# EAGLE design wordclockv0.1 (EAGLE 9.2.0)
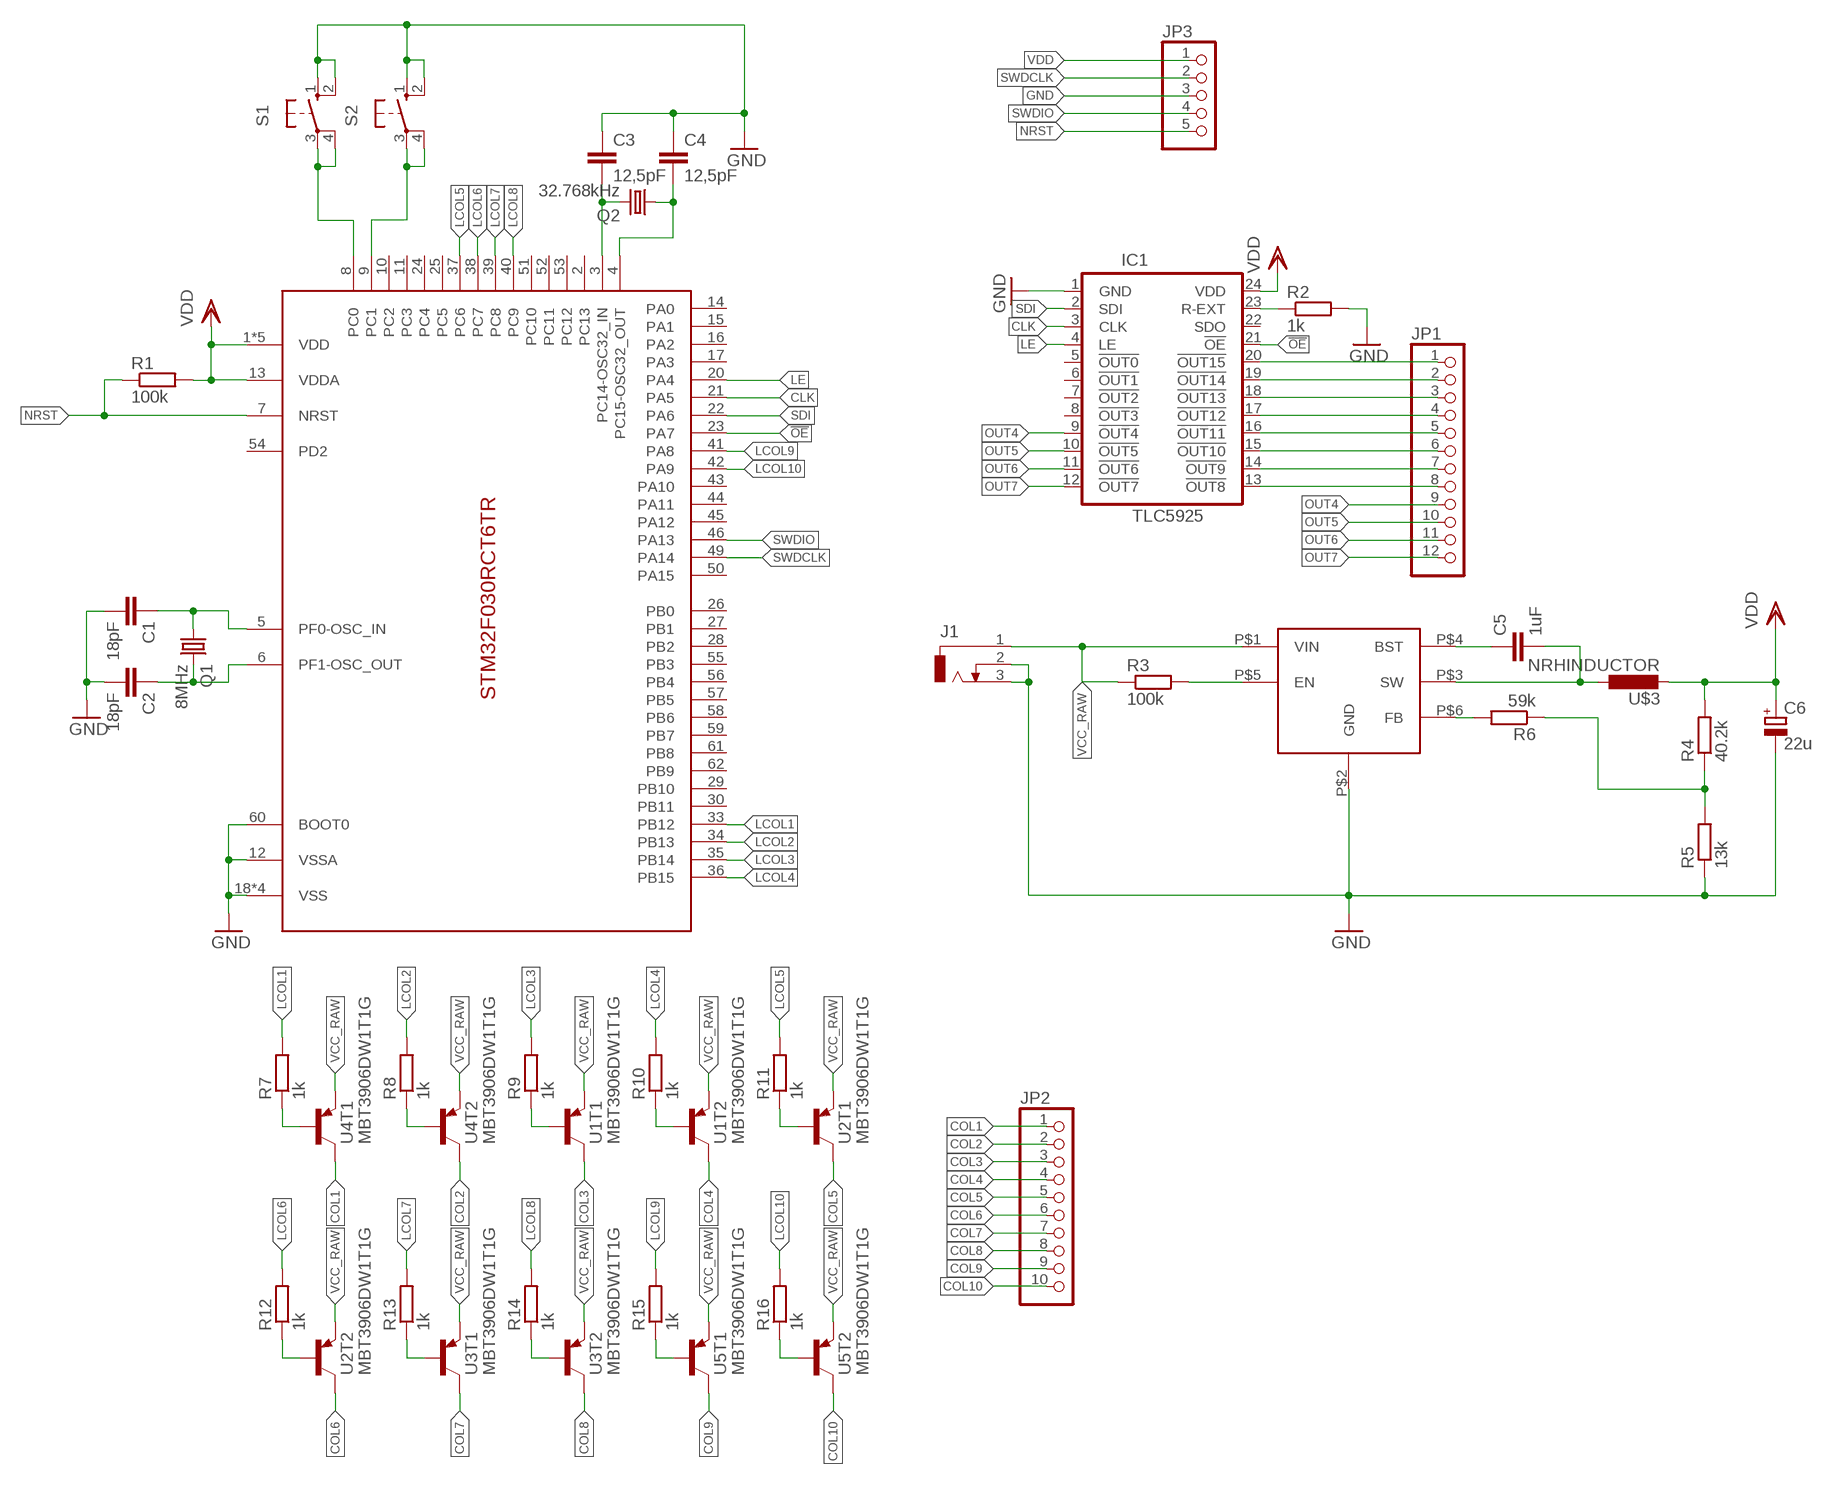
[diagram p0: schematic, sheet 1]

## Parts
C1  18pF  C-EUC0402  [C0402]
C2  18pF  C-EUC0402  [C0402]
C3  12,5pF  C-EUC0402  [C0402]
C4  12,5pF  C-EUC0402  [C0402]
C5  1uF  C-EUC0805  [C0805]
C6  22u  CPOL-EU153CLV-0405  [153CLV-0405]
IC1  TLC5925  [SO24W]
J1  DCJ0303  [DCJ0303]
JP1  PINHD-1X12  [1X12]
JP2  PINHD-1X10  [1X10]
JP3  PINHD-1X5  [1X05]
Q1  8MHz  CRYSTALHC49U-V  [HC49U-V]
Q2  32.768kHz  CRYSTALTC26V  [TC26V]
R1  100k  R-EU_M1206  [M1206]
R2  1k  R-EU_M1206  [M1206]
R3  100k  R-EU_M1206  [M1206]
R4  40.2k  R-EU_M1206  [M1206]
R5  13k  R-EU_M1206  [M1206]
R6  59k  R-EU_M1206  [M1206]
R7  1k  R-EU_M1206  [M1206]
R8  1k  R-EU_M1206  [M1206]
R9  1k  R-EU_M1206  [M1206]
R10  1k  R-EU_M1206  [M1206]
R11  1k  R-EU_M1206  [M1206]
R12  1k  R-EU_M1206  [M1206]
R13  1k  R-EU_M1206  [M1206]
R14  1k  R-EU_M1206  [M1206]
R15  1k  R-EU_M1206  [M1206]
R16  1k  R-EU_M1206  [M1206]
S1  10-XX  [B3F-10XX]
S2  10-XX  [B3F-10XX]
U1  MBT3906DW1T1G  [SOT363-INFINION]
U2  MBT3906DW1T1G  [SOT363-INFINION]
U3  MBT3906DW1T1G  [SOT363-INFINION]
U4  MBT3906DW1T1G  [SOT363-INFINION]
U5  MBT3906DW1T1G  [SOT363-INFINION]
U$1  STM32F030RCT6TRLQFP64  [LQFP64]
U$2  AP65111A  [TSOT26]
U$3  NRHINDUCTOR  [NRHINDUCTOR]

## Nets
!OE: IC1.21(!OE) U$1.23(PA7)
CLK: IC1.3(CLK) U$1.21(PA5)
COL1: JP2.1 U4.6(T1:C)
COL2: JP2.2 U4.3(T2:C)
COL3: JP2.3 U1.6(T1:C)
COL4: JP2.4 U1.3(T2:C)
COL5: JP2.5 U2.6(T1:C)
COL6: JP2.6 U2.3(T2:C)
COL7: JP2.7 U3.6(T1:C)
COL8: JP2.8 U3.3(T2:C)
COL9: JP2.9 U5.6(T1:C)
COL10: JP2.10 U5.3(T2:C)
GND: C1.2 C2.2 C3.1 C4.1 C6.- IC1.1(GND) J1.2 J1.3 JP3.3 R2.2 R5.1 S1.1(S) S1.2(S1) S2.1(S) S2.2(S1) U$1.12(VSSA) U$1.18(VSS) U$1.31(VSS) U$1.47(VSS) U$1.60(BOOT0) U$1.63(VSS) U$2.P$2(GND)
LCOL1: R7.2 U$1.33(PB12)
LCOL2: R8.2 U$1.34(PB13)
LCOL3: R9.2 U$1.35(PB14)
LCOL4: R10.2 U$1.36(PB15)
LCOL5: R11.2 U$1.37(PC6)
LCOL6: R12.2 U$1.38(PC7)
LCOL7: R13.2 U$1.39(PC8)
LCOL8: R14.2 U$1.40(PC9)
LCOL9: R15.2 U$1.41(PA8)
LCOL10: R16.2 U$1.42(PA9)
LE: IC1.4(LE) U$1.20(PA4)
N$1: C1.1 Q1.1 U$1.5(PF0-OSC_IN)
N$2: C2.1 Q1.2 U$1.6(PF1-OSC_OUT)
N$3: C4.2 Q2.1 U$1.4(PC15-OSC32_OUT)
N$4: C3.2 Q2.2 U$1.3(PC14-OSC32_IN)
N$6: C5.1 U$2.P$4(BST)
N$7: R3.2 U$2.P$5(EN)
N$9: IC1.23(R-EXT) R2.1
N$10: C5.2 U$2.P$3(SW) U$3.P$1
N$11: R6.2 U$2.P$6(FB)
N$12: R4.1 R5.2 R6.1
N$13: R7.1 U4.2(T1:B)
N$14: R8.1 U4.5(T2:B)
N$16: S1.3(P) S1.4(P1) U$1.8(PC0)
N$17: R9.1 U1.2(T1:B)
N$18: R10.1 U1.5(T2:B)
N$20: S2.3(P) S2.4(P1) U$1.9(PC1)
N$21: R11.1 U2.2(T1:B)
N$22: R12.1 U2.5(T2:B)
N$24: IC1.20(!OUT15) JP1.1
N$25: IC1.19(!OUT14) JP1.2
N$26: IC1.18(!OUT13) JP1.3
N$27: IC1.17(!OUT12) JP1.4
N$28: IC1.16(!OUT11) JP1.5
N$29: IC1.15(!OUT10) JP1.6
N$30: IC1.14(!OUT9) JP1.7
N$31: IC1.13(!OUT8) JP1.8
N$35: R13.1 U3.2(T1:B)
N$36: R14.1 U3.5(T2:B)
N$39: R15.1 U5.2(T1:B)
N$40: R16.1 U5.5(T2:B)
NRST: JP3.5 R1.1 U$1.7(NRST)
OUT4: IC1.9(!OUT4) JP1.9
OUT5: IC1.10(!OUT5) JP1.10
OUT6: IC1.11(!OUT6) JP1.11
OUT7: IC1.12(!OUT7) JP1.12
SDI: IC1.2(SDI) U$1.22(PA6)
SWDCLK: JP3.2 U$1.49(PA14)
SWDIO: JP3.4 U$1.46(PA13)
VCC_RAW: J1.1 R3.1 U1.1(T1:E) U1.4(T2:E) U2.1(T1:E) U2.4(T2:E) U3.1(T1:E) U3.4(T2:E) U4.1(T1:E) U4.4(T2:E) U5.1(T1:E) U5.4(T2:E) U$2.P$1(VIN)
VDD: C6.+ IC1.24(VDD) JP3.1 R1.2 R4.2 U$1.1(VDD) U$1.13(VDDA) U$1.19(VDD) U$1.32(VDD) U$1.48(VDD) U$1.64(VDD) U$3.P$2
Unconnected: IC1.5(!OUT0) IC1.6(!OUT1) IC1.7(!OUT2) IC1.8(!OUT3) IC1.22(SDO) U$1.2(PC13) U$1.10(PC2) U$1.11(PC3) U$1.14(PA0) U$1.15(PA1) U$1.16(PA2) U$1.17(PA3) U$1.24(PC4) U$1.25(PC5) U$1.26(PB0) U$1.27(PB1) U$1.28(PB2) U$1.29(PB10) U$1.30(PB11) U$1.43(PA10) U$1.44(PA11) U$1.45(PA12) U$1.50(PA15) U$1.51(PC10) U$1.52(PC11) U$1.53(PC12) U$1.54(PD2) U$1.55(PB3) U$1.56(PB4) U$1.57(PB5) U$1.58(PB6) U$1.59(PB7) U$1.61(PB8) U$1.62(PB9)

## Library data of the parts
C1 C3 C5 = rcl:C-EU: CAPACITOR, European symbol
C2 C4 = rcl:C-EU: CAPACITOR, European symbol; SPICEPREFIX: C
C6 = rcl:CPOL-EU: POLARIZED CAPACITOR, European symbol
IC1 = Treiberplatine:TLC5925
J1 = con-jack:DCJ0303: DC POWER JACK Source: DCJ0303.pdf; OC_FARNELL: unknown; OC_NEWARK: unknown
JP1 = pinhead:PINHD-1X12: PIN HEADER
JP2 = pinhead:PINHD-1X10: PIN HEADER
JP3 = pinhead:PINHD-1X5: PIN HEADER
Q1 = crystal:CRYSTAL: CRYSTAL; OC_FARNELL: 1666969; OC_NEWARK: unknown
Q2 = crystal:CRYSTAL: CRYSTAL; OC_FARNELL: unknown; OC_NEWARK: unknown
R1-R16 = rcl:R-EU_: RESISTOR, European symbol; SPICEPREFIX: R
S1 S2 = switch-omron:10-XX: OMRON SWITCH; MPN: B3F-1000; OC_FARNELL: 176432; OC_NEWARK: 36M3542
U1-U5 = STM32F030RCT6TR:MBT3906DW1T1G
U$1 = STM32F030RCT6TR:STM32F030RCT6TR
U$2 = STM32F030RCT6TR:AP65111A
U$3 = STM32F030RCT6TR:NRHINDUCTOR

## Board
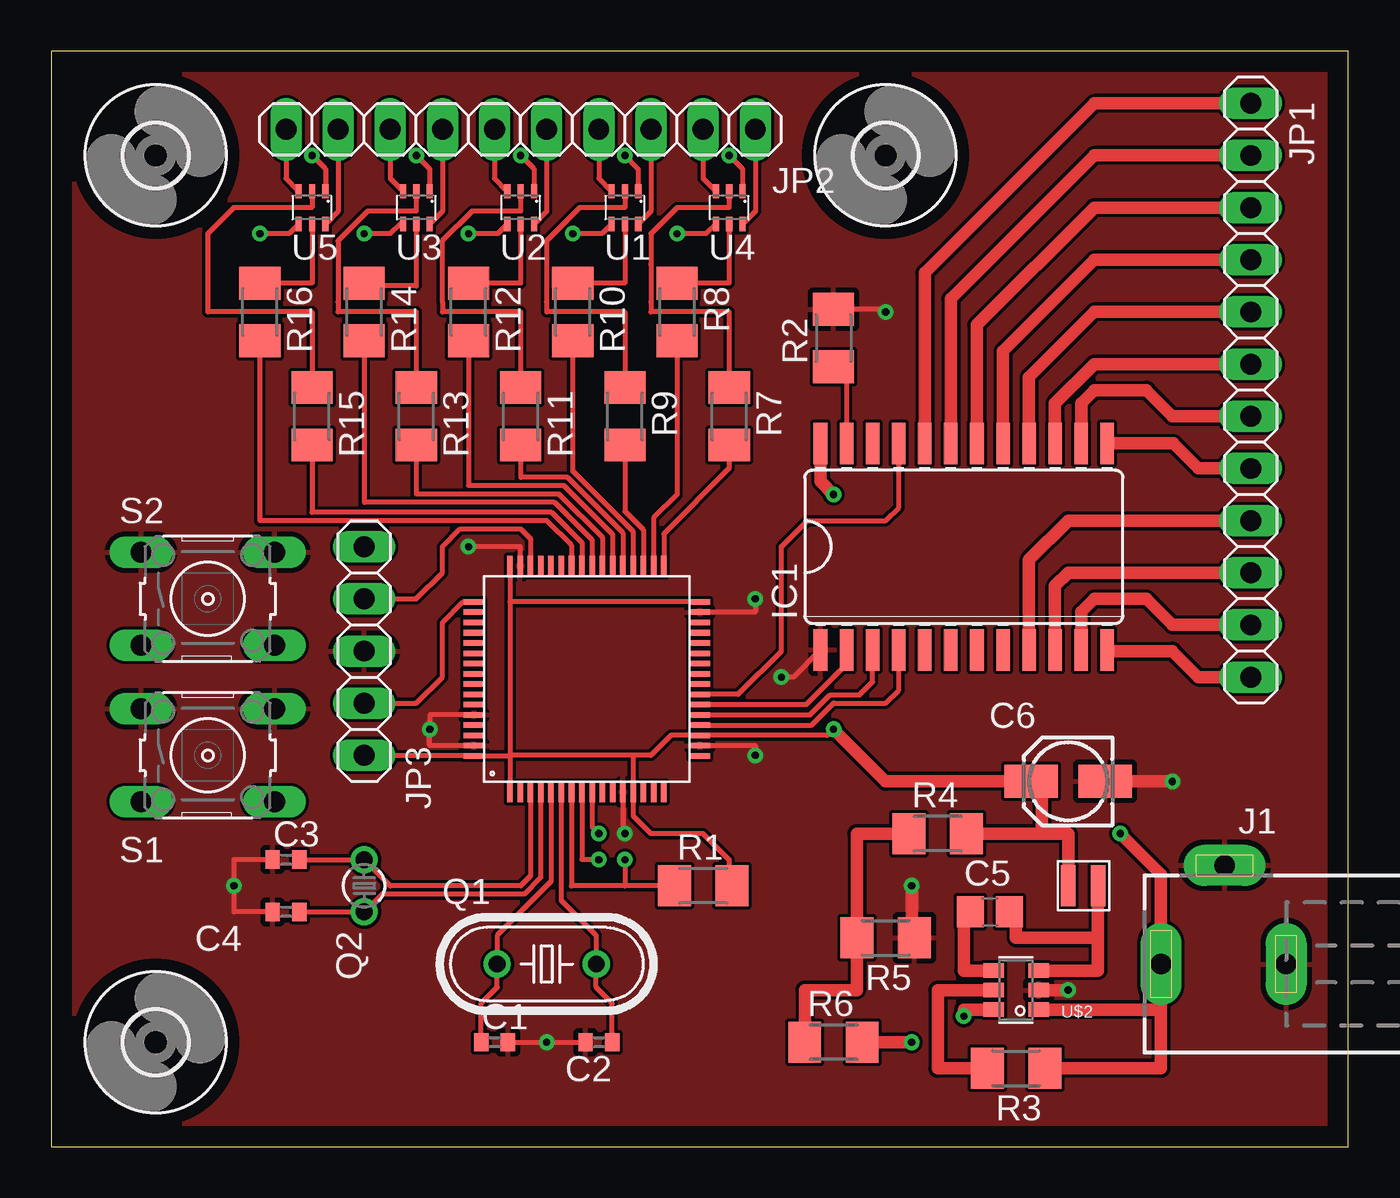
[diagram p1: board, top side]
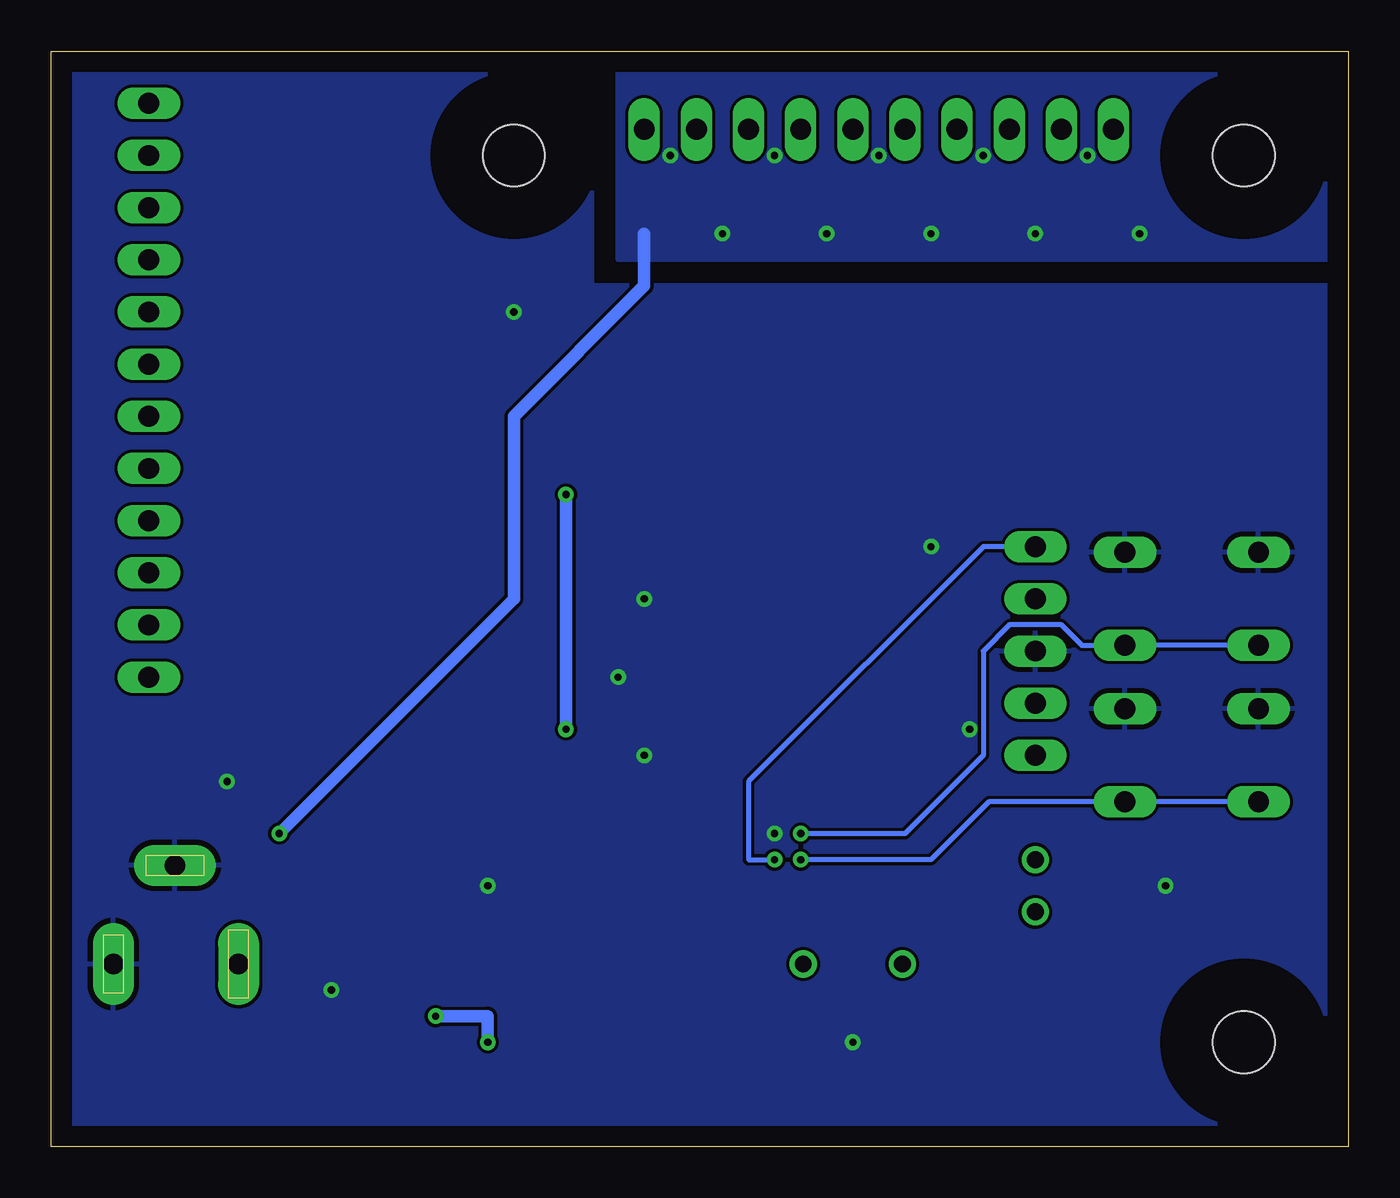
[diagram p2: board, bottom side, seen from below]

Size 63.17 x 53.33 mm. Coordinates in mm from the lower left corner, seen from the top.
Outline: 0,0 63.17,0 63.17,53.33 0,53.33 0,0
Copper layers (1*16): Top 0.035mm / dielectric 1.5mm / Bottom 0.035mm
Design rules "default *": minimum track width 6mil, minimum drill 0.35mm, track to track 6mil, track to pad 6mil, pad to pad 6mil, via to via 6mil, smd to smd 6mil, copper to edge 40mil, drill to drill 6mil, minimum pad ring 10mil, minimum via ring 8mil, stop-mask expansion 4mil, vias tented up to drill 0mil, thermal gap 10mil

### Footprints (pad centres in the part's own frame; a part is rotated, then mirrored left to right if it is on the bottom)
C0402 = smd 0.7 x 0.9: 1 -0.65,0; 2 0.65,0
C0805 = smd 1.3 x 1.5: 1 -0.95,0; 2 0.95,0
153CLV-0405 = smd 2.6 x 1.6: + 1.8,0; - -1.8,0
SO24W = smd 0.66 x 2.032: 1 -6.985,-5.029; 2 -5.715,-5.029; 3 -4.445,-5.029; 4 -3.175,-5.029; 5 -1.905,-5.029; 6 -0.635,-5.029; 7 0.635,-5.029; 8 1.905,-5.029; 9 3.175,-5.029; 10 4.445,-5.029; 11 5.715,-5.029; 12 6.985,-5.029; 13 6.985,5.029; 14 5.715,5.029; 15 4.445,5.029; 16 3.175,5.029; 17 1.905,5.029; 18 0.635,5.029; 19 -0.635,5.029; 20 -1.905,5.029; 21 -3.175,5.029; 22 -4.445,5.029; 23 -5.715,5.029; 24 -6.985,5.029
DCJ0303 = drill 1 pad 2 long: 1 0,3.1; 2 4.8,0; 3 0,-3
1X12 = drill 1.016 long: 1 -13.97,0; 2 -11.43,0; 3 -8.89,0; 4 -6.35,0; 5 -3.81,0; 6 -1.27,0; 7 1.27,0; 8 3.81,0; 9 6.35,0; 10 8.89,0; 11 11.43,0; 12 13.97,0
1X10 = drill 1.016 long: 1 -11.43,0; 2 -8.89,0; 3 -6.35,0; 4 -3.81,0; 5 -1.27,0; 6 1.27,0; 7 3.81,0; 8 6.35,0; 9 8.89,0; 10 11.43,0
1X05 = drill 1.016 long: 1 -5.08,0; 2 -2.54,0; 3 0,0; 4 2.54,0; 5 5.08,0
HC49U-V = drill 0.813: 1 -2.413,0; 2 2.413,0
TC26V = drill 0.813: 1 -1.27,0; 2 1.27,0
M1206 = smd 1.6 x 2: 1 -1.4,0; 2 1.4,0
B3F-10XX = drill 1.016 long: 1 -3.251,2.261; 2 3.251,2.261; 3 -3.251,-2.261; 4 3.251,-2.261
SOT363-INFINION = smd 0.3 x 0.7: 1 -0.65,-0.8; 2 0,-0.8; 3 0.65,-0.8; 4 0.65,0.8; 5 0,0.8; 6 -0.65,0.8
LQFP64 = smd 0.27 x 1: 1 -3.06,-5.59; 2 -2.56,-5.59; 3 -2.06,-5.59; 4 -1.56,-5.59; 5 -1.06,-5.59; 6 -0.56,-5.59; 7 -0.06,-5.59; 8 0.44,-5.59; 9 0.94,-5.59; 10 1.44,-5.59; 11 1.94,-5.59; 12 2.44,-5.59; 13 2.94,-5.59; 14 3.44,-5.59; 15 3.94,-5.59; 16 4.44,-5.59; 33 4.44,5.41; 34 3.94,5.41; 35 3.44,5.41; 36 2.94,5.41; 37 2.44,5.41; 38 1.94,5.41; 39 1.44,5.41; 40 0.94,5.41; 41 0.44,5.41; 42 -0.06,5.41; 43 -0.56,5.41; 44 -1.06,5.41; 45 -1.56,5.41; 46 -2.06,5.41; 47 -2.56,5.41; 48 -3.06,5.41 | smd 1 x 0.27: 17 6.19,-3.84; 18 6.19,-3.34; 19 6.19,-2.84; 20 6.19,-2.34; 21 6.19,-1.84; 22 6.19,-1.34; 23 6.19,-0.84; 24 6.19,-0.34; 25 6.19,0.16; 26 6.19,0.66; 27 6.19,1.16; 28 6.19,1.66; 29 6.19,2.16; 30 6.19,2.66; 31 6.19,3.16; 32 6.19,3.66; 49 -4.81,3.66; 50 -4.81,3.16; 51 -4.81,2.66; 52 -4.81,2.16; 53 -4.81,1.66; 54 -4.81,1.16; 55 -4.81,0.66; 56 -4.81,0.16; 57 -4.81,-0.34; 58 -4.81,-0.84; 59 -4.81,-1.34; 60 -4.81,-1.84; 61 -4.81,-2.34; 62 -4.81,-2.84; 63 -4.81,-3.34; 64 -4.81,-3.84
TSOT26 = smd 0.7 x 1: P$1 -0.95,-1.099; P$2 0,-1.099; P$3 0.95,-1.099; P$4 0.95,1.099; P$5 0,1.099; P$6 -0.95,1.099
NRHINDUCTOR = smd 0.7 x 2: P$1 -1.45,0; P$2 0,0
3,0 = hole 3: 0,0

### Placement (x,y rotation side)
C1  21.59,5.08 0 top
C2  26.67,5.08 180 top
C3  11.43,13.97 0 top
C4  11.43,11.43 0 top
C5  45.72,11.43 0 top
C6  49.53,17.78 180 top
IC1  44.45,29.21 0 top
J1  57.15,8.89 90 top
JP1  58.42,36.83 270 top
JP2  22.86,49.53 180 top
JP3  15.24,24.13 90 top
Q1  24.13,8.89 0 top
Q2  15.24,12.7 90 top
R1  31.75,12.7 0 top
R2  38.1,39.37 90 top
R3  46.99,3.81 180 top
R4  43.18,15.24 0 top
R5  40.64,10.16 180 top
R6  38.1,5.08 0 top
R7  33.02,35.56 270 top
R8  30.48,40.64 270 top
R9  27.94,35.56 270 top
R10  25.4,40.64 270 top
R11  22.86,35.56 270 top
R12  20.32,40.64 270 top
R13  17.78,35.56 270 top
R14  15.24,40.64 270 top
R15  12.7,35.56 270 top
R16  10.16,40.64 270 top
S1  7.62,19.05 0 top
S2  7.62,26.67 0 top
U1  27.94,45.72 180 top
U2  22.86,45.72 180 top
U3  17.78,45.72 180 top
U4  33.02,45.72 180 top
U5  12.7,45.72 180 top
U$1  25.4,22.86 0 top
U$2  46.99,7.62 90 top
U$3  49.53,12.7 180 top
U$4  [3,0]  5.08,48.26 0 top
U$5  [3,0]  40.64,48.26 0 top
U$6  [3,0]  5.08,5.08 0 top

### Tracks (layer width: path | path; a pad name or v marks a point on that pad's centre or on a via)
!OE
  Top 0.254: U$1.23 33.45,22.02 35.56,24.13 35.56,29.21 36.83,30.48 40.64,30.48 41.27,31.11 IC1.21
CLK
  Top 0.254: IC1.3 40.01,22.63 39.37,22 37.93,22 36.95,21.02 U$1.21
COL1
  Top 0.254: U4.6 34.29,45.54 JP2.1
COL2
  Top 0.254: U4.3 31.75,47.14 JP2.2
COL3
  Top 0.254: U1.6 29.21,45.54 JP2.3
COL4
  Top 0.254: U1.3 26.67,47.14 JP2.4
COL5
  Top 0.254: U2.6 24.13,45.54 JP2.5
COL6
  Top 0.254: U2.3 21.59,47.14 JP2.6
COL7
  Top 0.254: JP2.7 19.05,45.54 U3.6
COL8
  Top 0.254: U3.3 16.51,47.14 JP2.8
COL9
  Top 0.254: U5.6 13.97,45.54 JP2.9
COL10
  Top 0.254: U5.3 11.43,47.14 JP2.10
GND  (via drill 0.35)
  Top 0.254: U$1.47 22.84,29.21 v20.32,29.21 | C4.1 8.89,11.43 v8.89,12.7 8.89,13.97 C3.1 | U$1.31 34.29,26.02 v34.29,26.67 | U$1.18 34.29,19.52 v34.29,19.05 | U$1.12 27.84,15.24 v27.94,15.24 | R2.2 40.51,40.77 v40.64,40.64 | IC1.1 36.14,22.86 v35.56,22.86 | C1.2 v24.13,5.08 C2.2 | U$1.60 18.44,21.02 v18.44,20.32 18.44,19.52 U$1.63
  Top 0.61: v54.61,17.78 C6.- | v49.53,7.62 U$2.P$2 | R5.1 41.91,10.16 v41.91,12.7
  pour Bottom: 0,41.91 36.83,41.91 36.83,53.34 63.5,53.34 63.5,0 0,0
  pour Top: 0,53.34 0,0 63.5,0 63.5,53.34
LCOL1
  Top 0.254: U$1.33 29.84,29.84 33.02,33.02 R7.2
LCOL2
  Top 0.254: U$1.34 29.34,30.61 30.48,31.75 R8.2
LCOL3
  Top 0.254: R9.2 27.94,30.93 28.84,30.03 U$1.35
LCOL4
  Top 0.254: R10.2 25.4,32.9 28.34,29.96 U$1.36
LCOL5
  Top 0.254: R11.2 22.86,32.59 25.14,32.59 27.84,29.89 U$1.37
LCOL6
  Top 0.254: R12.2 20.32,32.18 24.97,32.18 27.34,29.81 U$1.38
LCOL7
  Top 0.254: R13.2 17.78,31.77 24.74,31.77 26.84,29.68 U$1.39
LCOL8
  Top 0.254: R14.2 15.24,31.37 24.51,31.37 26.34,29.54 U$1.40
LCOL9
  Top 0.254: R15.2 12.7,30.89 24.36,30.89 25.84,29.41 U$1.41
LCOL10
  Top 0.254: R16.2 10.16,30.48 24.13,30.48 25.34,29.27 U$1.42
LE
  Top 0.254: IC1.4 41.27,22.23 40.64,21.59 38.1,21.59 37.03,20.52 U$1.20
N$1
  Top 0.254: U$1.5 24.34,12.91 21.72,10.29 Q1.1 21.72,7.75 20.94,6.97 C1.1
N$2
  Top 0.254: U$1.6 24.84,11.99 26.54,10.29 Q1.2 26.54,7.75 27.32,6.97 C2.1
N$3
  Top 0.254: U$1.4 23.84,13.11 23.03,12.29 16.1,12.29 Q2.1 C4.2
N$4
  Top 0.254: U$1.3 23.34,13.18 22.86,12.7 16.51,12.7 Q2.2 C3.2
N$6
  Top 0.61: U$2.P$4 44.45,8.57 44.45,11.43 C5.1
N$7
  Top 0.61: U$2.P$5 43.18,7.62 43.18,3.81 R3.2
N$9
  Top 0.254: IC1.23 38.73,37.97 R2.1
N$10
  Top 0.61: U$2.P$3 50.98,8.57 50.98,10.16 | C5.2 46.99,11.11 46.99,10.16 50.98,10.16 | U$3.P$1 50.98,10.16
N$11  (via drill 0.35)
  Top 0.61: v41.91,5.08 R6.2 | v44.45,6.35 44.45,6.67 U$2.P$6
  Bottom 0.61: v41.91,5.08 41.91,6.35 v44.45,6.35
N$12
  Top 0.61: R4.1 39.24,15.24 R5.2 39.24,7.62 36.7,7.62 R6.1
N$13
  Top 0.254: R7.1 33.02,40.64 29.21,40.64 29.21,41.12 29.2,41.12 29.2,42.96 29.21,42.97 29.21,44.45 30.48,45.72 33.02,45.72 U4.2
N$14
  Top 0.254: R8.1 33.02,42.04 U4.5
N$16  (via drill 0.35)
  Top 0.254: U$1.8 25.84,13.97 v26.67,13.97
  Bottom 0.254: v26.67,13.97 20.32,13.97 17.5,16.79 S1.4 S1.3
N$17
  Top 0.254: U1.2 27.94,45.72 25.74,45.72 24.12,44.1 24.12,41.12 24.13,41.12 24.13,40.64 27.94,40.64 R9.1
N$18
  Top 0.254: R10.1 27.94,42.04 U1.5
N$20  (via drill 0.35)
  Top 0.254: v26.67,15.24 26.34,15.57 U$1.9
  Bottom 0.254: v26.67,15.24 21.59,15.24 17.78,19.05 17.78,24.13 16.51,25.4 13.97,25.4 12.98,24.41 S2.4 S2.3
N$21
  Top 0.254: U2.2 22.86,45.55 20.49,45.55 19.04,44.1 19.04,41.12 19.05,41.12 19.05,40.64 22.86,40.64 R11.1
N$22
  Top 0.254: R12.1 22.86,42.04 U2.5
N$24
  Top 0.61: IC1.20 42.55,42.55 50.8,50.8 JP1.1
N$25
  Top 0.61: IC1.19 43.81,41.27 50.8,48.26 JP1.2
N$26
  Top 0.61: IC1.18 45.09,40.01 50.8,45.72 JP1.3
N$27
  Top 0.61: IC1.17 46.35,38.73 50.8,43.18 JP1.4
N$28
  Top 0.61: IC1.16 47.62,37.47 50.8,40.64 JP1.5
N$29
  Top 0.61: IC1.15 48.9,36.2 50.8,38.1 JP1.6
N$30
  Top 0.61: IC1.14 50.16,36.2 50.8,36.83 53.34,36.83 54.61,35.56 JP1.7
N$31
  Top 0.61: IC1.13 54.66,34.24 55.88,33.02 JP1.8
N$35
  Top 0.254: U3.2 17.78,45.55 15.41,45.55 13.96,44.1 13.96,41.12 13.97,41.12 13.97,40.64 17.78,40.64 R13.1
N$36
  Top 0.254: U3.5 17.78,41.91 15.37,41.91 R14.1
N$39
  Top 0.254: U5.2 12.7,45.72 8.89,45.72 7.62,44.45 7.62,40.64 12.7,40.64 R15.1
N$40
  Top 0.254: U5.5 12.7,42.04 R16.1
NRST  (via drill 0.35)
  Top 0.254: U$1.7 25.34,12.7 27.94,12.7 | R1.1 27.94,12.7 | v27.94,13.97 27.94,12.7
  Bottom 0.254: JP3.5 17.78,29.21 29.21,17.78 29.21,13.97 v27.94,13.97
OUT4
  Top 0.61: IC1.9 47.62,28.57 49.53,30.48 JP1.9
OUT5
  Top 0.61: IC1.10 48.9,27.3 49.53,27.94 JP1.10
OUT6
  Top 0.61: IC1.11 50.16,26.04 50.8,26.67 53.34,26.67 54.61,25.4 JP1.11
OUT7
  Top 0.61: IC1.12 51.49,24.13 54.61,24.13 55.88,22.86 JP1.12
SDI
  Top 0.254: IC1.2 38.73,23.5 36.76,21.52 U$1.22
SWDCLK
  Top 0.254: U$1.49 20.06,26.52 19.05,25.51 19.05,22.86 17.78,21.59 JP3.2
SWDIO
  Top 0.254: JP3.4 17.78,26.67 19.05,27.94 19.05,29.21 19.91,30.07 21.18,30.07 21.59,30.07 22.86,30.07 23.34,29.59 U$1.46
VCC_RAW  (via drill 0.35)
  Top 0.254: U4.1 33.67,47.61 v33.02,48.26 | U4.4 31.9,44.45 v30.48,44.45 | U1.1 28.59,47.61 v27.94,48.26 | U1.4 26.82,44.45 v25.4,44.45 | U2.1 23.51,47.61 v22.86,48.26 | U2.4 21.74,44.45 v20.32,44.45 | U3.1 18.43,47.61 v17.78,48.26 | U3.4 16.98,44.92 16.51,44.45 v15.24,44.45 | U5.1 13.35,47.61 v12.7,48.26 | U5.4 11.58,44.45 v10.16,44.45
  Top 0.61: 54.05,6.67 U$2.P$1 | 54.05,6.67 J1.1 54.05,13.26 v52.07,15.24 | R3.1 54.05,3.81 54.05,6.67
  Bottom 0.61: v52.07,15.24 40.64,26.67 40.64,35.56 34.29,41.91 34.29,44.45
  pour Bottom: 0,53.34 0,43.18 35.56,43.18 35.56,53.34
VDD  (via drill 0.35)
  Top 0.254: 28.32,19.05 29.21,19.05 30.18,20.02 U$1.19 37.8,20.02 v38.1,20.32 | 28.32,19.05 22.34,19.05 | 28.32,19.05 28.34,19.03 U$1.13 28.34,16.11 29.21,15.24 31.75,15.24 33.02,13.97 33.02,12.83 R1.2 | U$1.48 22.34,26.52 | 22.34,26.52 22.34,19.05 | 22.34,19.05 U$1.1 | U$1.32 22.34,26.52 | 22.34,19.05 22.31,19.02 U$1.64 15.27,19.02 JP3.1
  Top 0.61: U$3.P$2 49.53,15.24 48.26,15.24 | 48.26,15.24 48.26,17.78 C6.+ 40.64,17.78 v38.1,20.32 | v38.1,31.75 37.47,32.38 IC1.24 | 48.26,15.24 R4.2
  Bottom 0.61: v38.1,31.75 v38.1,20.32